# Altium schematic sheet deepshark_ecs.SchDoc
size A4
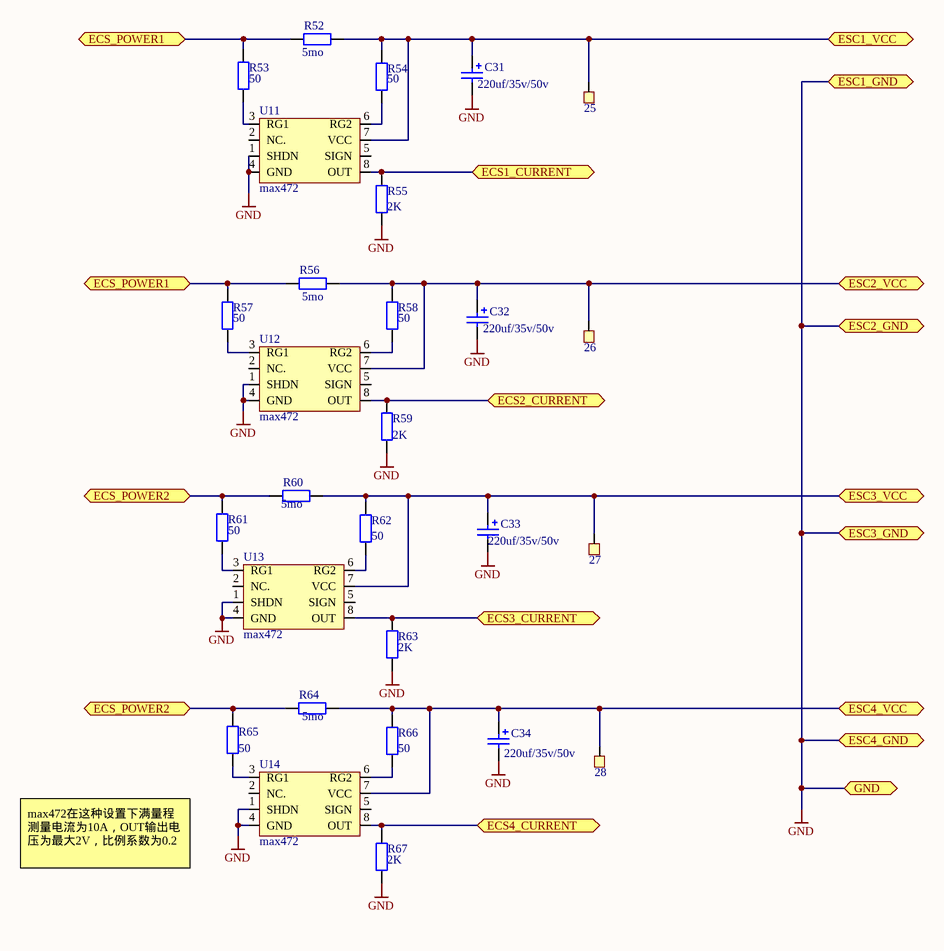
[diagram p0: deepshark_ecs.SchDoc]

## Parts
25  TP  [TestPoint]  (value not drawn)
26  TP  [TestPoint]  (value not drawn)
27  TP  [TestPoint]  (value not drawn)
28  TP  [TestPoint]  (value not drawn)
C31  value 220uf/35v/50v  [220uf-50v]  (hidden comment: Cap Pol2)
C32  value 220uf/35v/50v  [220uf-50v]  (hidden comment: Cap Pol2)
C33  value 220uf/35v/50v  [220uf-50v]  (hidden comment: Cap Pol2)
C34  value 220uf/35v/50v  [220uf-50v]  (hidden comment: Cap Pol2)
R52  value 5mo  [5mo]  (hidden comment: Res2)
R53  value 50  [my0603]  (hidden comment: Res2)
R54  value 50  [my0603]  (hidden comment: Res2)
R55  value 2K  [6-0805_M]  (hidden comment: Res2)
R56  value 5mo  [5mo]  (hidden comment: Res2)
R57  value 50  [my0603]  (hidden comment: Res2)
R58  value 50  [my0603]  (hidden comment: Res2)
R59  value 2K  [6-0805_M]  (hidden comment: Res2)
R60  value 5mo  [5mo]  (hidden comment: Res2)
R61  value 50  [my0603]  (hidden comment: Res2)
R62  value 50  [my0603]  (hidden comment: Res2)
R63  value 2K  [6-0805_M]  (hidden comment: Res2)
R64  value 5mo  [5mo]  (hidden comment: Res2)
R65  value 50  [my0603]  (hidden comment: Res2)
R66  value 50  [my0603]  (hidden comment: Res2)
R67  value 2K  [6-0805_M]  (hidden comment: Res2)
U11  max472  [SO-8_M]
U12  max472  [SO-8_M]
U13  max472  [SO-8_M]
U14  max472  [SO-8_M]

## Ports
ECS1_CURRENT, ECS2_CURRENT, ECS3_CURRENT, ECS4_CURRENT, ECS_POWER1, ECS_POWER2, ESC1_GND, ESC1_VCC, ESC2_GND, ESC2_VCC, ESC3_GND, ESC3_VCC, ESC4_GND, ESC4_VCC, GND

## Nets
GND: C31.2 C32.2 C33.2 C34.2 R55.1 R59.1 R63.1 R67.1 U11.1(SHDN) U11.4(GND) U12.1(SHDN) U12.4(GND) U13.1(SHDN) U13.4(GND) U14.1(SHDN) U14.4(GND) ; port ESC1_GND, port ESC2_GND, port ESC3_GND, port ESC4_GND, port GND
ECS1_CURRENT: R55.2 U11.8(OUT) ; port ECS1_CURRENT
ECS2_CURRENT: R59.2 U12.8(OUT) ; port ECS2_CURRENT
ECS3_CURRENT: R63.2 U13.8(OUT) ; port ECS3_CURRENT
ECS4_CURRENT: R67.2 U14.8(OUT) ; port ECS4_CURRENT
ECS_POWER1: R52.1 R53.2 R56.1 R57.2 ; port ECS_POWER1
ECS_POWER2: R60.1 R61.2 R64.1 R65.2 ; port ECS_POWER2
ESC1_VCC: 25.1 C31.1 R52.2 R54.2 U11.7(VCC) ; port ESC1_VCC
ESC2_VCC: 26.1 C32.1 R56.2 R58.2 U12.7(VCC) ; port ESC2_VCC
ESC3_VCC: 27.1 C33.1 R60.2 R62.2 U13.7(VCC) ; port ESC3_VCC
ESC4_VCC: 28.1 C34.1 R64.2 R66.2 U14.7(VCC) ; port ESC4_VCC
NetR53_1: R53.1 U11.3(RG1)
NetR54_1: R54.1 U11.6(RG2)
NetR57_1: R57.1 U12.3(RG1)
NetR58_1: R58.1 U12.6(RG2)
NetR61_1: R61.1 U13.3(RG1)
NetR62_1: R62.1 U13.6(RG2)
NetR65_1: R65.1 U14.3(RG1)
NetR66_1: R66.1 U14.6(RG2)

Not connected (* = marked no-connect by the designer): U11 2(NC.) 5(SIGN); U12 2(NC.) 5(SIGN); U13 2(NC.) 5(SIGN); U14 2(NC.) 5(SIGN)

## Notes on the sheet
- max472在这种设置下满量程测量电流为10A，OUT输出电压为最大2V，比例系数为0.2

## Library data of the parts
C31-C34 = Cap Pol2: Polarized Capacitor (Axial); Published: 8-Jun-2000; LatestRevisionDate: 17-Jul-2002; LatestRevisionNote: Re-released for DXP Platform.; PackageReference: POLAR0.8; Publisher: Altium Limited; PackageDescription: Polarized Capacitor; 2 Leads
R52-R67 = Res2: Resistor; Published: 8-Jun-2000; LatestRevisionDate: 17-Jul-2002; LatestRevisionNote: Re-released for DXP Platform.; PackageReference: AXIAL-0.4; Publisher: Altium Limited; PackageDescription: Axial Device, Thru-Hole; 2 Leads; 0.4 in Pin Spacing